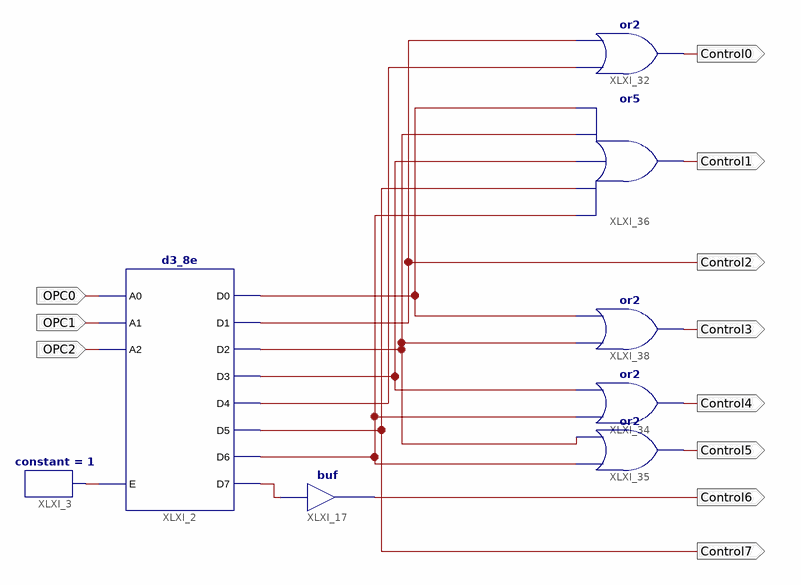
[diagram p0: schematic sheet 1]
// Xilinx ISE schematic Instruction_Decoder.sch (virtex6) as structural Verilog: 8 symbols, 11 ports
module Instruction_Decoder (
  input  OPC0,
  input  OPC2,
  input  OPC1,
  output Control0,
  output Control4,
  output Control5,
  output Control6,
  output Control3,
  output Control2,
  output Control1,
  output Control7
);

  wire XLXN_12, XLXN_49, XLXN_93, XLXN_96, XLXN_98, XLXN_100, XLXN_103;

  d3_8e XLXI_2 (
    .A0(OPC0), .A1(OPC1), .A2(OPC2), .E(XLXN_12), .D0(XLXN_93), .D1(Control2), .D2(XLXN_96), .D3(XLXN_98),
    .D4(XLXN_100), .D5(Control7), .D6(XLXN_103), .D7(XLXN_49));
  constant #(.CValue("1")) XLXI_3 (.O(XLXN_12));
  or XLXI_32 (Control0, XLXN_100, Control2);
  or XLXI_34 (Control4, XLXN_103, XLXN_98);
  or XLXI_35 (Control5, XLXN_103, XLXN_96);
  or XLXI_36 (Control1, XLXN_103, Control7, XLXN_98, XLXN_96, XLXN_93);
  or XLXI_38 (Control3, XLXN_96, XLXN_93);
  buf XLXI_17 (Control6, XLXN_49);
endmodule
